# Altium schematic sheet v1.0.SchDoc
size 111 x 58 mm
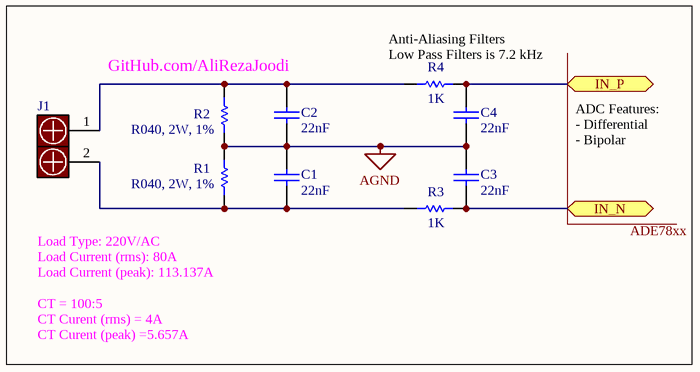
[diagram p0: v1.0.SchDoc]

## Parts
C1  22nF  [SMD_0805]
C2  22nF  [SMD_0805]
C3  22nF  [SMD_0805]
C4  22nF  [SMD_0805]
J1  (no value)  [1x2_P8.26]
R1  R040, 2W, 1%  [SMD_4527]
R2  R040, 2W, 1%  [SMD_4527]
R3  1K  [SMD_0805]
R4  1K  [SMD_0805]

## Ports
IN_N, IN_P

## Nets
AGND: C1.1 C2.2 C3.1 C4.2 R1.2 R2.1
IN_N: C3.2 R3.1 ; port IN_N
IN_P: C4.1 R4.1 ; port IN_P
NetC1_2: C1.2 J1.2 R1.1 R3.2
NetC2_1: C2.1 J1.1 R2.2 R4.2

## Notes on the sheet
- GitHub.com/AliRezaJoodi
- (near R4) Anti-Aliasing Filters
  Low Pass Filters is 7.2 kHz
- ADC Features:
  - Differential
  - Bipolar
- ADE78xx
- (near R1) Load Type: 220V/AC
  Load Current (rms): 80A
  Load Current (peak): 113.137A
  CT = 100:5
  CT Curent (rms) = 4A
  CT Curent (peak) =5.657A

## Library data of the parts
C1-C4 = Capacitor_Ceramic: Capacitor, Ceramic Multilayer; Revision: July-2002: Re-released for DXP Platform.
J1 = Connector1x2_Power_4Form: Connector, Barrier Terminal Blocks, 2Pin; Revision: July-2002: Re-released for DXP Platform.
R1 R2 = Resistor: Resistor, 2W, 1%; Revision: July-2002: Re-released for DXP Platform.
R3 R4 = Resistor: Resistor, 1/8W; Revision: July-2002: Re-released for DXP Platform.